# EAGLE design irobot virtualwall (EAGLE 9.6.1)
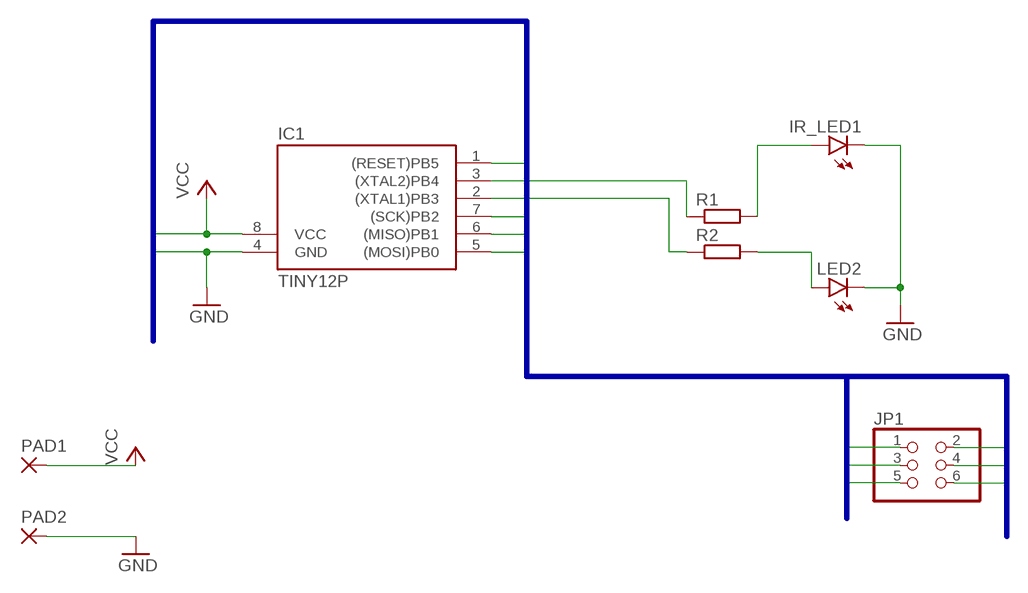
[diagram p0: schematic, sheet 1]

## Parts
IC1  TINY12P  [DIL08]
IR_LED1  LED5MM  [LED5MM]
JP1  PINHD-2X3  [2X03]
LED2  LED5MM  [LED5MM]
PAD1  2,54/0,8  [2,54/0,8]
PAD2  2,54/0,8  [2,54/0,8]
R1  R-EU_0207/10  [0207/10]
R2  R-EU_0207/10  [0207/10]

## Nets
CLK: IC1.7((SCK)PB2) JP1.3
GND: IC1.4(GND) IR_LED1.K(C) JP1.6 LED2.K(C) PAD2.1(P)
MISO: IC1.6((MISO)PB1) JP1.1
MOSI: IC1.5((MOSI)PB0) JP1.4
N$1: IC1.3((XTAL2)PB4) R1.1
N$2: IC1.2((XTAL1)PB3) R2.1
N$3: IR_LED1.A R1.2
N$4: LED2.A R2.2
RST: IC1.1((RESET)PB5) JP1.5
VCC: IC1.8(VCC) JP1.2 PAD1.1(P)

## Buses
CLK,GND,MISO,MOSI,RST,VCC

## Library data of the parts
IC1 = atmel:TINY12*: MICROCONTROLLER 1 Kbytes FLASH 64 bytes EEPROM; OC_FARNELL: unknown; OC_NEWARK: unknown
IR_LED1 LED2 = led:LED: LED OSRAM: - CHIPLED LG R971, LG N971, LY N971, LG Q971, LY Q971, LO R971, LY R971 LH N974, LH R974 LS Q976, LO Q976, LY Q976 LO Q996 - Hyper CHIPLED LW Q18S LB Q993, LB Q99A, LB R99A - SideLED LS A670, LO A670, LY A670, LG A670, LP A670 LB A673, LV A673, LT A673, LW A673 LH A674 LY A675 LS A676, LA A676, LO A676, LY A676, LW A676 LS A679, LY A679, LG A679 - Hyper Micro SIDELED® LS Y876, LA Y876, LO Y876, LY Y876 LT Y87S - SmartLED LW L88C, LW L88S LB L89C, LB L89S, LG L890 LS L89K, LO L89K, LY L89K LS L896, LA L896, LO L896, LY L896 - TOPLED LS T670, LO T670, LY T670, LG T670, LP T670 LSG T670, LSP T670, LSY T670, LOP T670, LYG T670 LG T671, LOG T671, LSG T671 LB T673, LV T673, LT T673, LW T673 LH T674 LS T676, LA T676, LO T676, LY T676, LB T676, LH T676, LSB T676, LW T676 LB T67C, LV T67C, LT T67C, LS T67K, LO T67K, LY T67K, LW E67C LS E67B, LA E67B, LO E67B, LY E67B, LB E67C, LV E67C, LT E67C LW T67C LS T679, LY T679, LG T679 LS T770, LO T770, LY T770, LG T770, LP T770 LB T773, LV T773, LT T773, LW T773 LH T774 LS E675, LA E675, LY E675, LS T675 LS T776, LA T776, LO T776, LY T776, LB T776 LHGB T686 LT T68C, LB T68C - Hyper Mini TOPLED® LB M676 - Mini TOPLED Santana® LG M470 LS M47K, LO M47K, LY M47K Source: http://www.osram.convergy.de LUXEON: - LUMILED® LXK2-PW12-R00, LXK2-PW12-S00, LXK2-PW14-U00, LXK2-PW14-V00 LXK2-PM12-R00, LXK2-PM12-S00, LXK2-PM14-U00 LXK2-PE12-Q00, LXK2-PE12-R00, LXK2-PE12-S00, LXK2-PE14-T00, LXK2-PE14-U00 LXK2-PB12-K00, LXK2-PB12-L00, LXK2-PB12-M00, LXK2-PB14-N00, LXK2-PB14-P00, LXK2-PB14-Q00 LXK2-PR12-L00, LXK2-PR12-M00, LXK2-PR14-Q00, LXK2-PR14-R00 LXK2-PD12-Q00, LXK2-PD12-R00, LXK2-PD12-S00 LXK2-PH12-R00, LXK2-PH12-S00 LXK2-PL12-P00, LXK2-PL12-Q00, LXK2-PL12-R00 Source: www.luxeon.com KINGBRIGHT: KA-3528ASYC Source: www.kingbright.com
JP1 = pinhead:PINHD-2X3: PIN HEADER
PAD1 PAD2 = wirepad:2,54/0,8: THROUGH-HOLE PAD
R1 R2 = rcl:R-EU_: RESISTOR, European symbol; SPICEPREFIX: R

## Board
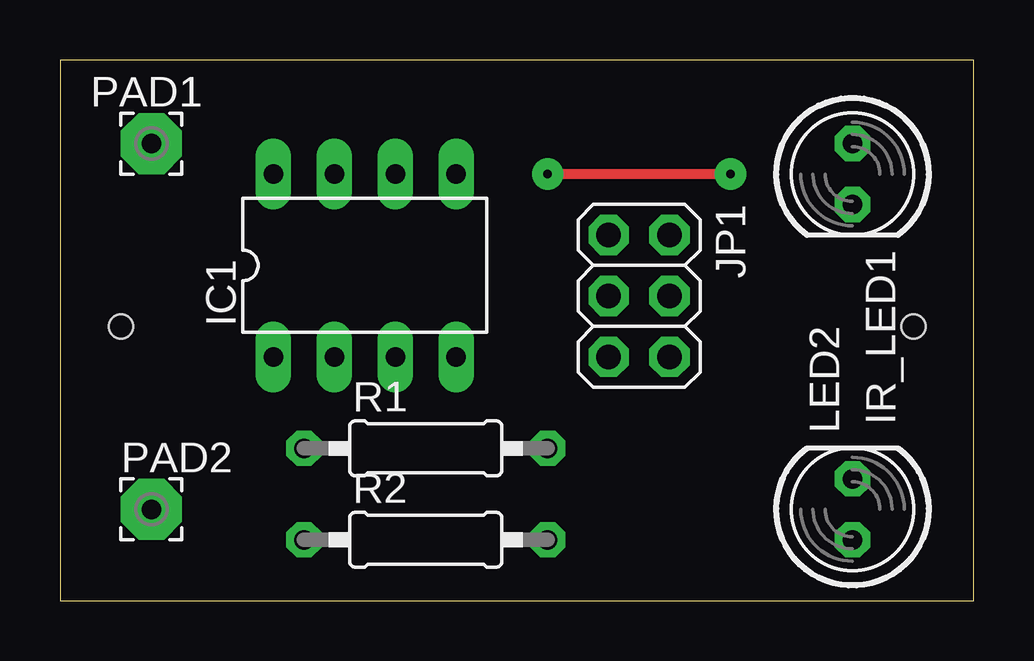
[diagram p1: board, top side]
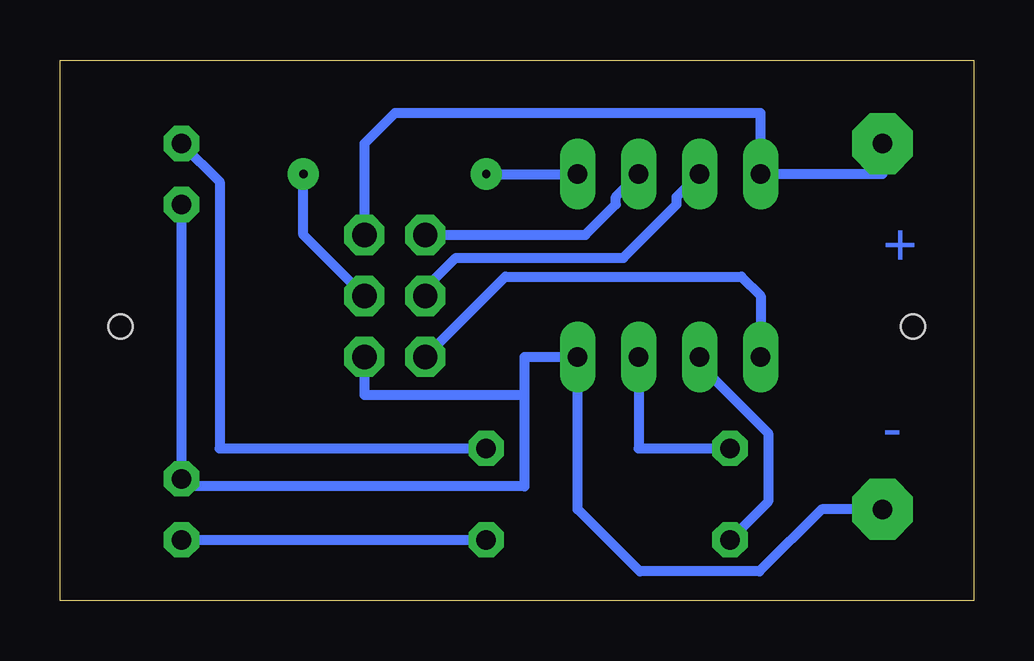
[diagram p2: board, bottom side, seen from below]

Size 38.08 x 22.53 mm. Coordinates in mm from the lower left corner, seen from the top.
Outline: 0,0 38.08,0 38.08,22.53 0,22.53 0,0
Copper layers (1*16): Top 0.035mm / dielectric 1.5mm / Bottom 0.035mm
Design rules "default *": minimum track width 16mil, minimum drill 0.35mm, track to track 15mil, track to pad 15mil, pad to pad 9mil, via to via 9mil, smd to smd 6mil, copper to edge 40mil, drill to drill 6mil, minimum pad ring 13mil, minimum via ring 8mil, stop-mask expansion 4mil, vias tented up to drill 0mil, thermal gap 10mil
Holes 1 mm at 2.54,11.43 35.56,11.43

### Footprints (pad centres in the part's own frame; a part is rotated, then mirrored left to right if it is on the bottom)
DIL08 = drill 0.813 long: 1 -3.81,-3.81; 2 -1.27,-3.81; 3 1.27,-3.81; 4 3.81,-3.81; 5 3.81,3.81; 6 1.27,3.81; 7 -1.27,3.81; 8 -3.81,3.81
LED5MM = drill 0.813 octagon: A -1.27,0; K 1.27,0
2X03 = drill 1.016 octagon: 1 -2.54,-1.27; 2 -2.54,1.27; 3 0,-1.27; 4 0,1.27; 5 2.54,-1.27; 6 2.54,1.27
2,54/0,8 = drill 0.813 pad 2.54 octagon: 1 0,0
0207/10 = drill 0.813 octagon: 1 -5.08,0; 2 5.08,0

### Placement (x,y rotation side)
IC1  12.7,13.97 0 top
IR_LED1  33.02,17.78 270 top
JP1  24.13,12.7 270 top
LED2  33.02,3.81 90 top
PAD1  3.81,19.05 0 top
PAD2  3.81,3.81 0 top
R1  15.24,6.35 0 top
R2  15.24,2.54 0 top

### Tracks (layer width: path | path; a pad name or v marks a point on that pad's centre or on a via)
CLK
  Bottom 0.406: IC1.7 12.38,16.83 12.38,16.51 14.6,14.29 21.59,14.29 22.86,13.02 JP1.3
GND
  Bottom 0.406: IR_LED1.K LED2.K 33.02,4.76 18.73,4.76 18.73,8.57 | 18.73,8.57 25.4,8.57 JP1.6 | 18.73,8.57 18.73,10.16 IC1.4 16.51,3.81 13.92,1.22 8.94,1.22 6.35,3.81 PAD2.1
MISO
  Bottom 0.406: IC1.6 14.92,16.83 14.92,16.51 16.19,15.24 JP1.1
MOSI  (via drill 0.35 pad 1.3)
  Top 0.406: v27.94,17.78 v20.32,17.78
  Bottom 0.406: JP1.4 27.94,15.24 v27.94,17.78 | v20.32,17.78 IC1.5
N$1
  Bottom 0.406: R1.1 13.97,6.35 IC1.3
N$2
  Bottom 0.406: R2.1 8.57,4.13 8.57,6.99 11.43,9.84 IC1.2
N$3
  Bottom 0.406: R1.2 31.43,6.35 31.43,17.46 IR_LED1.A
N$4
  Bottom 0.406: LED2.A R2.2
RST
  Bottom 0.406: JP1.5 19.52,13.5 9.69,13.5 8.89,12.7 IC1.1
VCC
  Bottom 0.406: PAD1.1 3.81,17.78 IC1.8 8.89,20.32 24.13,20.32 25.4,19.05 JP1.2

### Text on the board
Bottom: + | -